# EAGLE design Zio Qwiic SHT31 Temperature & Humidity Sensor (EAGLE 9.1.1)
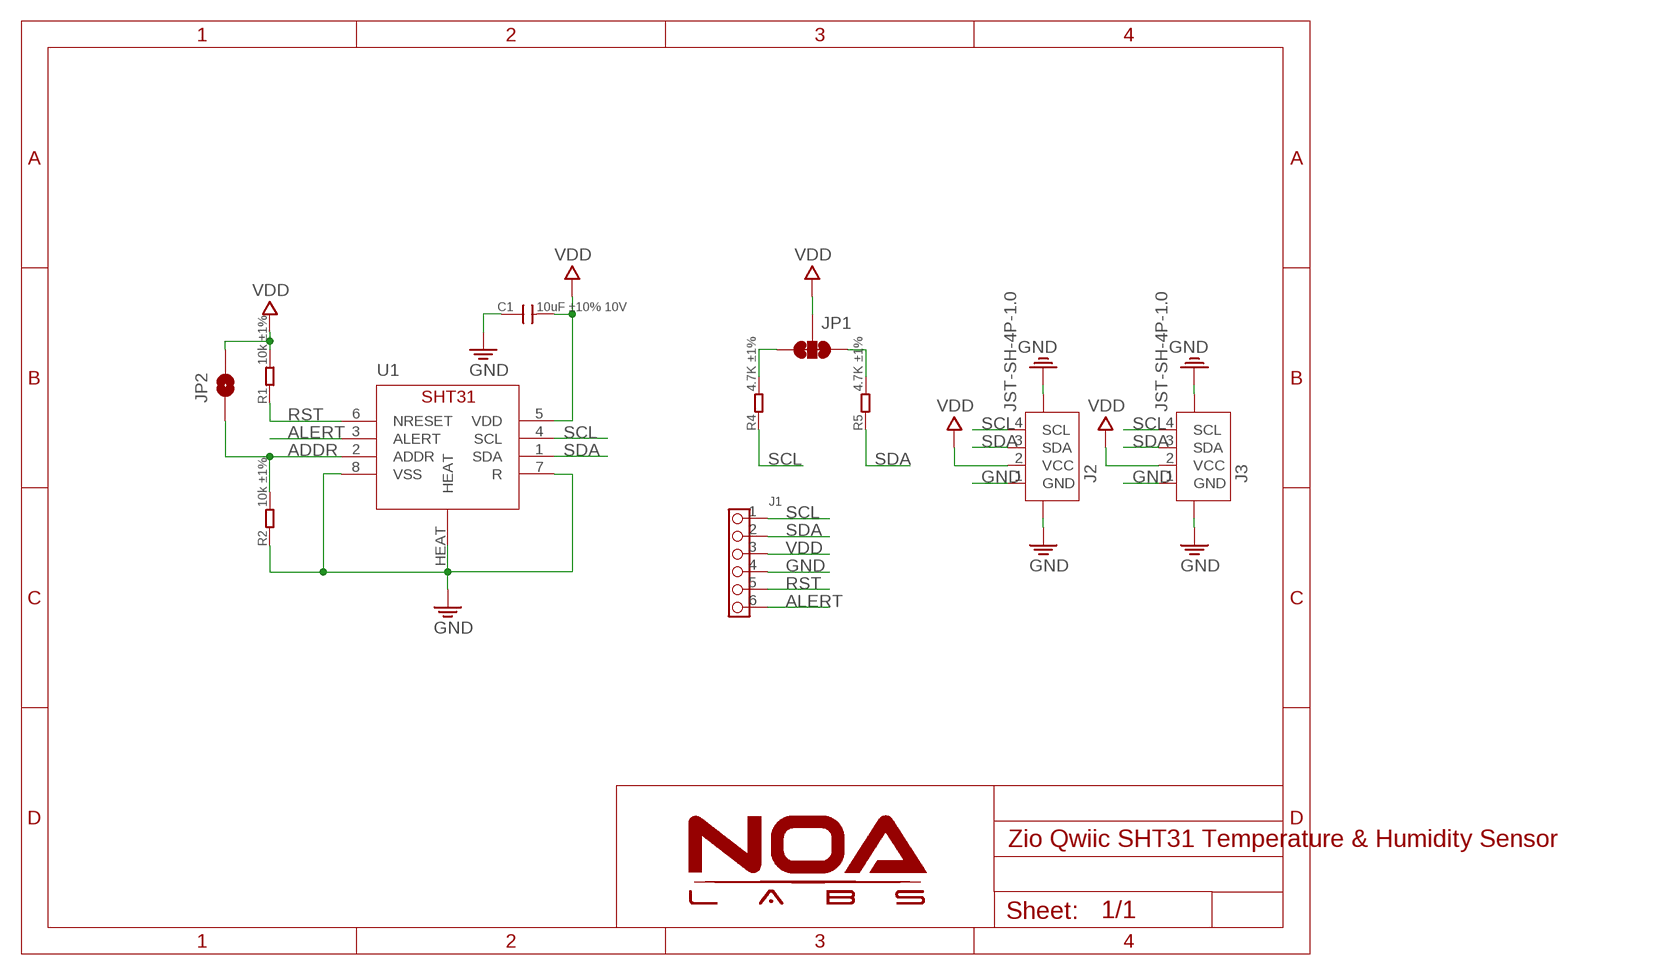
[diagram p0: schematic, sheet 1]

## Parts
C1  10uF ±10% 10V  C-0603  [C0603]
J1  HEADER-6P-60/35MIL  [6P-2.54-60/35MIL]
J2  JST-SH-4P-1.0  [JST-SH-4P]
J3  JST-SH-4P-1.0  [JST-SH-4P]
JP1  SMT-JUMPER_3_2-NC_TRACE  [SMT-JUMPER_3_2-NC_TRACE]
JP2  JUMPER-SMT_2_NC_PASTE_NOCREM  [SMT-JUMPER_2_NC_PASTE_SILK_NOCREM]
R1  10k ±1%  R-0603  [R0603]
R2  10k ±1%  R-0603  [R0603]
R4  4.7K ±1%  R-0603  [R0603]
R5  4.7K ±1%  R-0603  [R0603]
U1  SHT31  [DFN8]

## Nets
ADDR: JP2.1 R2.2 U1.2(ADDR)
ALERT: J1.6 U1.3(ALERT)
GND: C1.1 J1.4 J2.1(GND) J2.NC1 J2.NC2 J3.1(GND) J3.NC1 J3.NC2 R2.1 U1.7(R) U1.8(VSS) U1.HEAT
N$6: JP1.3 R4.2
N$8: JP1.1 R5.2
RST: J1.5 R1.1 U1.6(NRESET)
SCL: J1.1 J2.4(SCL) J3.4(SCL) R4.1 U1.4(SCL)
SDA: J1.2 J2.3(SDA) J3.3(SDA) R5.1 U1.1(SDA)
VDD: C1.2 J1.3 J2.2(VCC) J3.2(VCC) JP1.2 JP2.2 R1.2 U1.5(VDD)

## Library data of the parts
C1 = RCL:C
J1 = Connector_NOA:HEADER-6P
J2 J3 = Connector:JST-SH-4P
JP1 = NOA-Jumpers:SMT-JUMPER_3_2-NC_TRACE
JP2 = NOA-Jumpers:JUMPER-SMT_2_NC_PASTE_NOCREM
R1 R2 R4 R5 = RCL:R
U1 = IC:SHT31

## Board
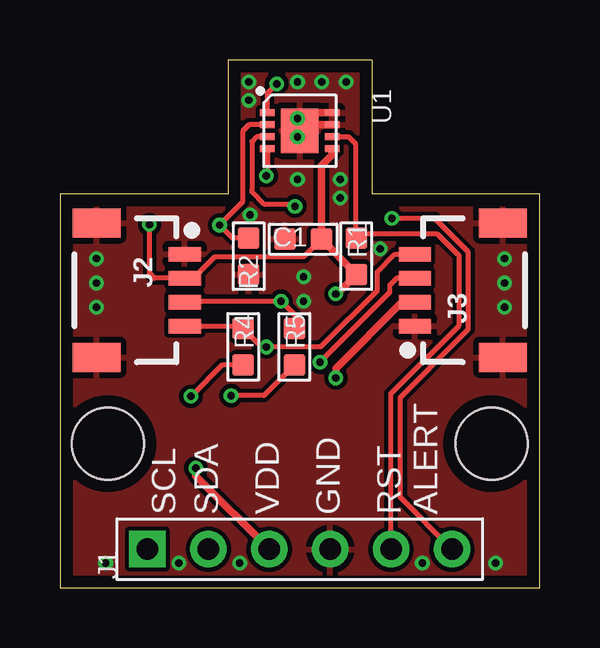
[diagram p1: board, top side]
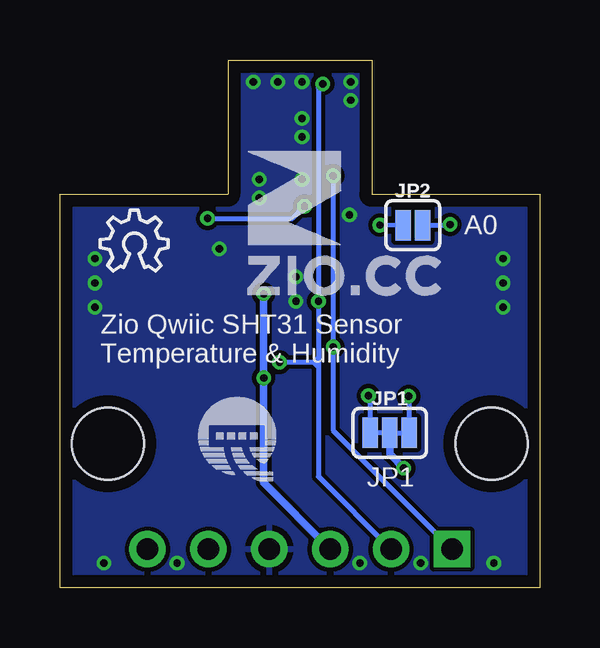
[diagram p2: board, bottom side, seen from below]

Size 20 x 22 mm. Coordinates in mm from the lower left corner, seen from the top.
Outline: 0,0 20,0 20,16.4 13,16.4 13,22 7,22 7,16.4 0,16.4 0,0
Copper layers (1*16): Top 0.035mm / dielectric 1.5mm / Bottom 0.035mm
Design rules "NOA Eagle Rule": minimum track width 7mil, minimum drill 12mil, track to track 7mil, track to pad 7mil, pad to pad 7mil, via to via 7mil, smd to smd 0mil, copper to edge 20mil, drill to drill 10mil, minimum pad ring 10mil, minimum via ring 6mil, stop-mask expansion 2mil, vias tented up to drill 25mil, thermal gap 10mil
Holes 3 mm at 2,6 18,6

### Footprints (pad centres in the part's own frame; a part is rotated, then mirrored left to right if it is on the bottom)
C0603 = smd 0.889 x 0.889: 1 -0.762,0; 2 0.762,0
6P-2.54-60/35MIL = drill 0.889 pad 1.524 square: 1 0,6.35 | drill 0.889 pad 1.524: 2 0,3.81; 3 0,1.27; 4 0,-1.27; 5 0,-3.81; 6 0,-6.35
JST-SH-4P = smd 0.6 x 1.35: 1 1.5,0; 2 0.5,0; 3 -0.5,0; 4 -1.5,0 | smd 1.2 x 2: NC1 -2.8,3.675; NC2 2.8,3.675
SMT-JUMPER_3_2-NC_TRACE = smd 0.635 x 1.27: 1 -0.813,0; 2 0,0; 3 0.813,0
SMT-JUMPER_2_NC_PASTE_SILK_NOCREM = smd 0.635 x 1.27: 1 -0.406,0; 2 0.406,0
R0603 = smd 0.889 x 0.889: 1 -0.762,0; 2 0.762,0
DFN8 = smd 0.3 x 0.6: 1 -0.75,-1.35; 2 -0.25,-1.35; 3 0.25,-1.35; 4 0.75,-1.35; 5 0.75,1.35; 6 0.25,1.35; 7 -0.25,1.35; 8 -0.75,1.35 | smd 1.85 x 1.55: HEAT 0,0

### Placement (x,y rotation side)
C1  10.15,14.53 0 top
J1  10,1.6 90 top
J2  5.2,12.4 90 top
J3  14.8,12.4 270 top
JP1  6.25,6.45 0 bottom
JP2  5.28,15.11 0 bottom
R1  12.36,13.82 270 top
R2  7.87,13.82 90 top
R4  7.65,10.03 270 top
R5  9.78,10.03 270 top
U1  10,19.05 270 top
U$3  [OSHW_6X100_NOTEXT]  18.31,13.21 0 bottom
U$4  [6MM]  12.19,12.19 0 bottom
U$5  [QWIIC-LOGO-BASIC]  12.65,6.15 0 bottom

### Tracks (layer width: path | path; a pad name or v marks a point on that pad's centre or on a via)
ADDR  (via drill 0.3)
  Top 0.178: v6.66,15.11
  Top 0.203: U1.2 7.89,19.3 7.62,19.03 7.62,16.08 v6.66,15.11 7.19,14.58 R2.2
  Bottom 0.178: v6.66,15.11 JP2.1
ALERT  (via drill 0.3)
  Top 0.203: U1.3 8.21,18.8 8,18.59 8,16.59 8,16.5 8.53,15.97 9.73,15.97 v9.8,15.9 | J1.6 14.19,3.76 14.19,7.92 16.66,10.4 16.66,10.41 17.03,10.78 17.03,13.99 15.63,15.39 v13.84,15.39
  Bottom 0.203: v13.84,15.39 10.31,15.39 v9.8,15.9
GND  (via drill 0.3)
  Top 0.305: U1.8 10.75,19.8 U1.HEAT 10.25,19.3 U1.7
  other vias: 1.52,13.72 9.91,17.02 7.87,21.08 7.87,20.32 9.91,21.08 10.92,21.08 11.94,21.08 11.68,17.02 11.68,16.26 9.91,19.56 9.91,18.8 7.92,15.54 18.54,13.72 18.54,12.7 18.54,11.68 1.52,12.7 1.52,11.68 7.49,1.02 4.95,1.02 15.11,1.02 18.16,1.02 1.91,1.02 10.16,11.94 10.16,12.95 13.36,14.12
  pour Top: 0,16.41 7.01,16.41 7.01,22 13,22 13,16.41 19.99,16.41 19.99,0 0,0
  pour Bottom: 0,16.41 7.01,16.41 7.01,22 13,22 13,16.41 19.99,16.41 19.99,0 0,0
N$6  (via drill 0.3)
  Top 0.203: R4.2 6.76,9.27 v5.46,7.98
  Bottom 0.203: JP1.3 5.44,7.95 v5.46,7.98
N$8  (via drill 0.3)
  Top 0.203: R5.2 8.51,8 v7.14,8
  Bottom 0.203: 7.06,7.92 v7.14,8 7.06,7.92 | JP1.1 7.06,7.92
RST
  Top 0.203: U1.6 12.04,18.8 12.32,18.52 12.32,14.63 R1.1 12.51,14.73 15.75,14.73 16.65,13.83 16.65,10.94 13.81,8.1 J1.5
SCL  (via drill 0.3)
  Top 0.203: U1.4 8.65,17.21 v8.61,17.17 | J2.4 7.54,10.9 R4.1 8.41,10.03 v8.61,10.03 10.87,10.03 13.23,12.39 13.23,13.16 13.98,13.9 J3.4
  Bottom 0.203: v8.61,17.17 8.61,10.87 v8.61,10.03 8.61,6.56 J1.1
SDA  (via drill 0.3)
  Top 0.203: U1.1 8.65,20.61 v9.04,21.01 | J2.3 5.24,11.94 v9.22,11.94 9.78,11.38 R5.1 | J3.3 14.04,12.9 13.74,12.6 13.74,12.29 v10.85,9.4
  Bottom 0.203: v9.04,21.01 9.22,20.83 v9.22,11.94 9.22,9.6 | J1.2 9.22,4.63 9.22,9.2 | 9.22,9.6 9.22,9.2 | v10.85,9.4 9.42,9.4 | 9.42,9.4 9.22,9.6 | 9.42,9.4 9.22,9.2
VDD  (via drill 0.3)
  Top 0.203: C1.2 10.17,13.79 6.46,13.79 5.57,12.9 5.31,12.9 J2.2 3.94,12.9 3.73,13.11 v3.73,15.14
  Top 0.305: U1.5 11.35,18.03 10.91,17.59 C1.2 R1.2 11.55,12.24 v11.51,12.24 | J1.3 5.66,4.67 v5.66,4.98 | J3.2 14.26,11.9 11.51,9.14 v11.51,8.74
  Bottom 0.203: JP2.2 3.76,15.11 v3.73,15.14
  Bottom 0.305: v11.51,12.24 v11.51,8.74 11.51,4.38 J1.3 | JP1.2 6.25,5.56 v5.66,4.98

### Text on the board
tPlace: SCL | SDA | VDD | GND | RST | ALERT
bPlace: A0 | Zio Qwiic SHT31 Sensor / Temperature & Humidity | JP1